# Altium schematic sheet 09 DDR3.SchDoc
size 420 x 297 mm
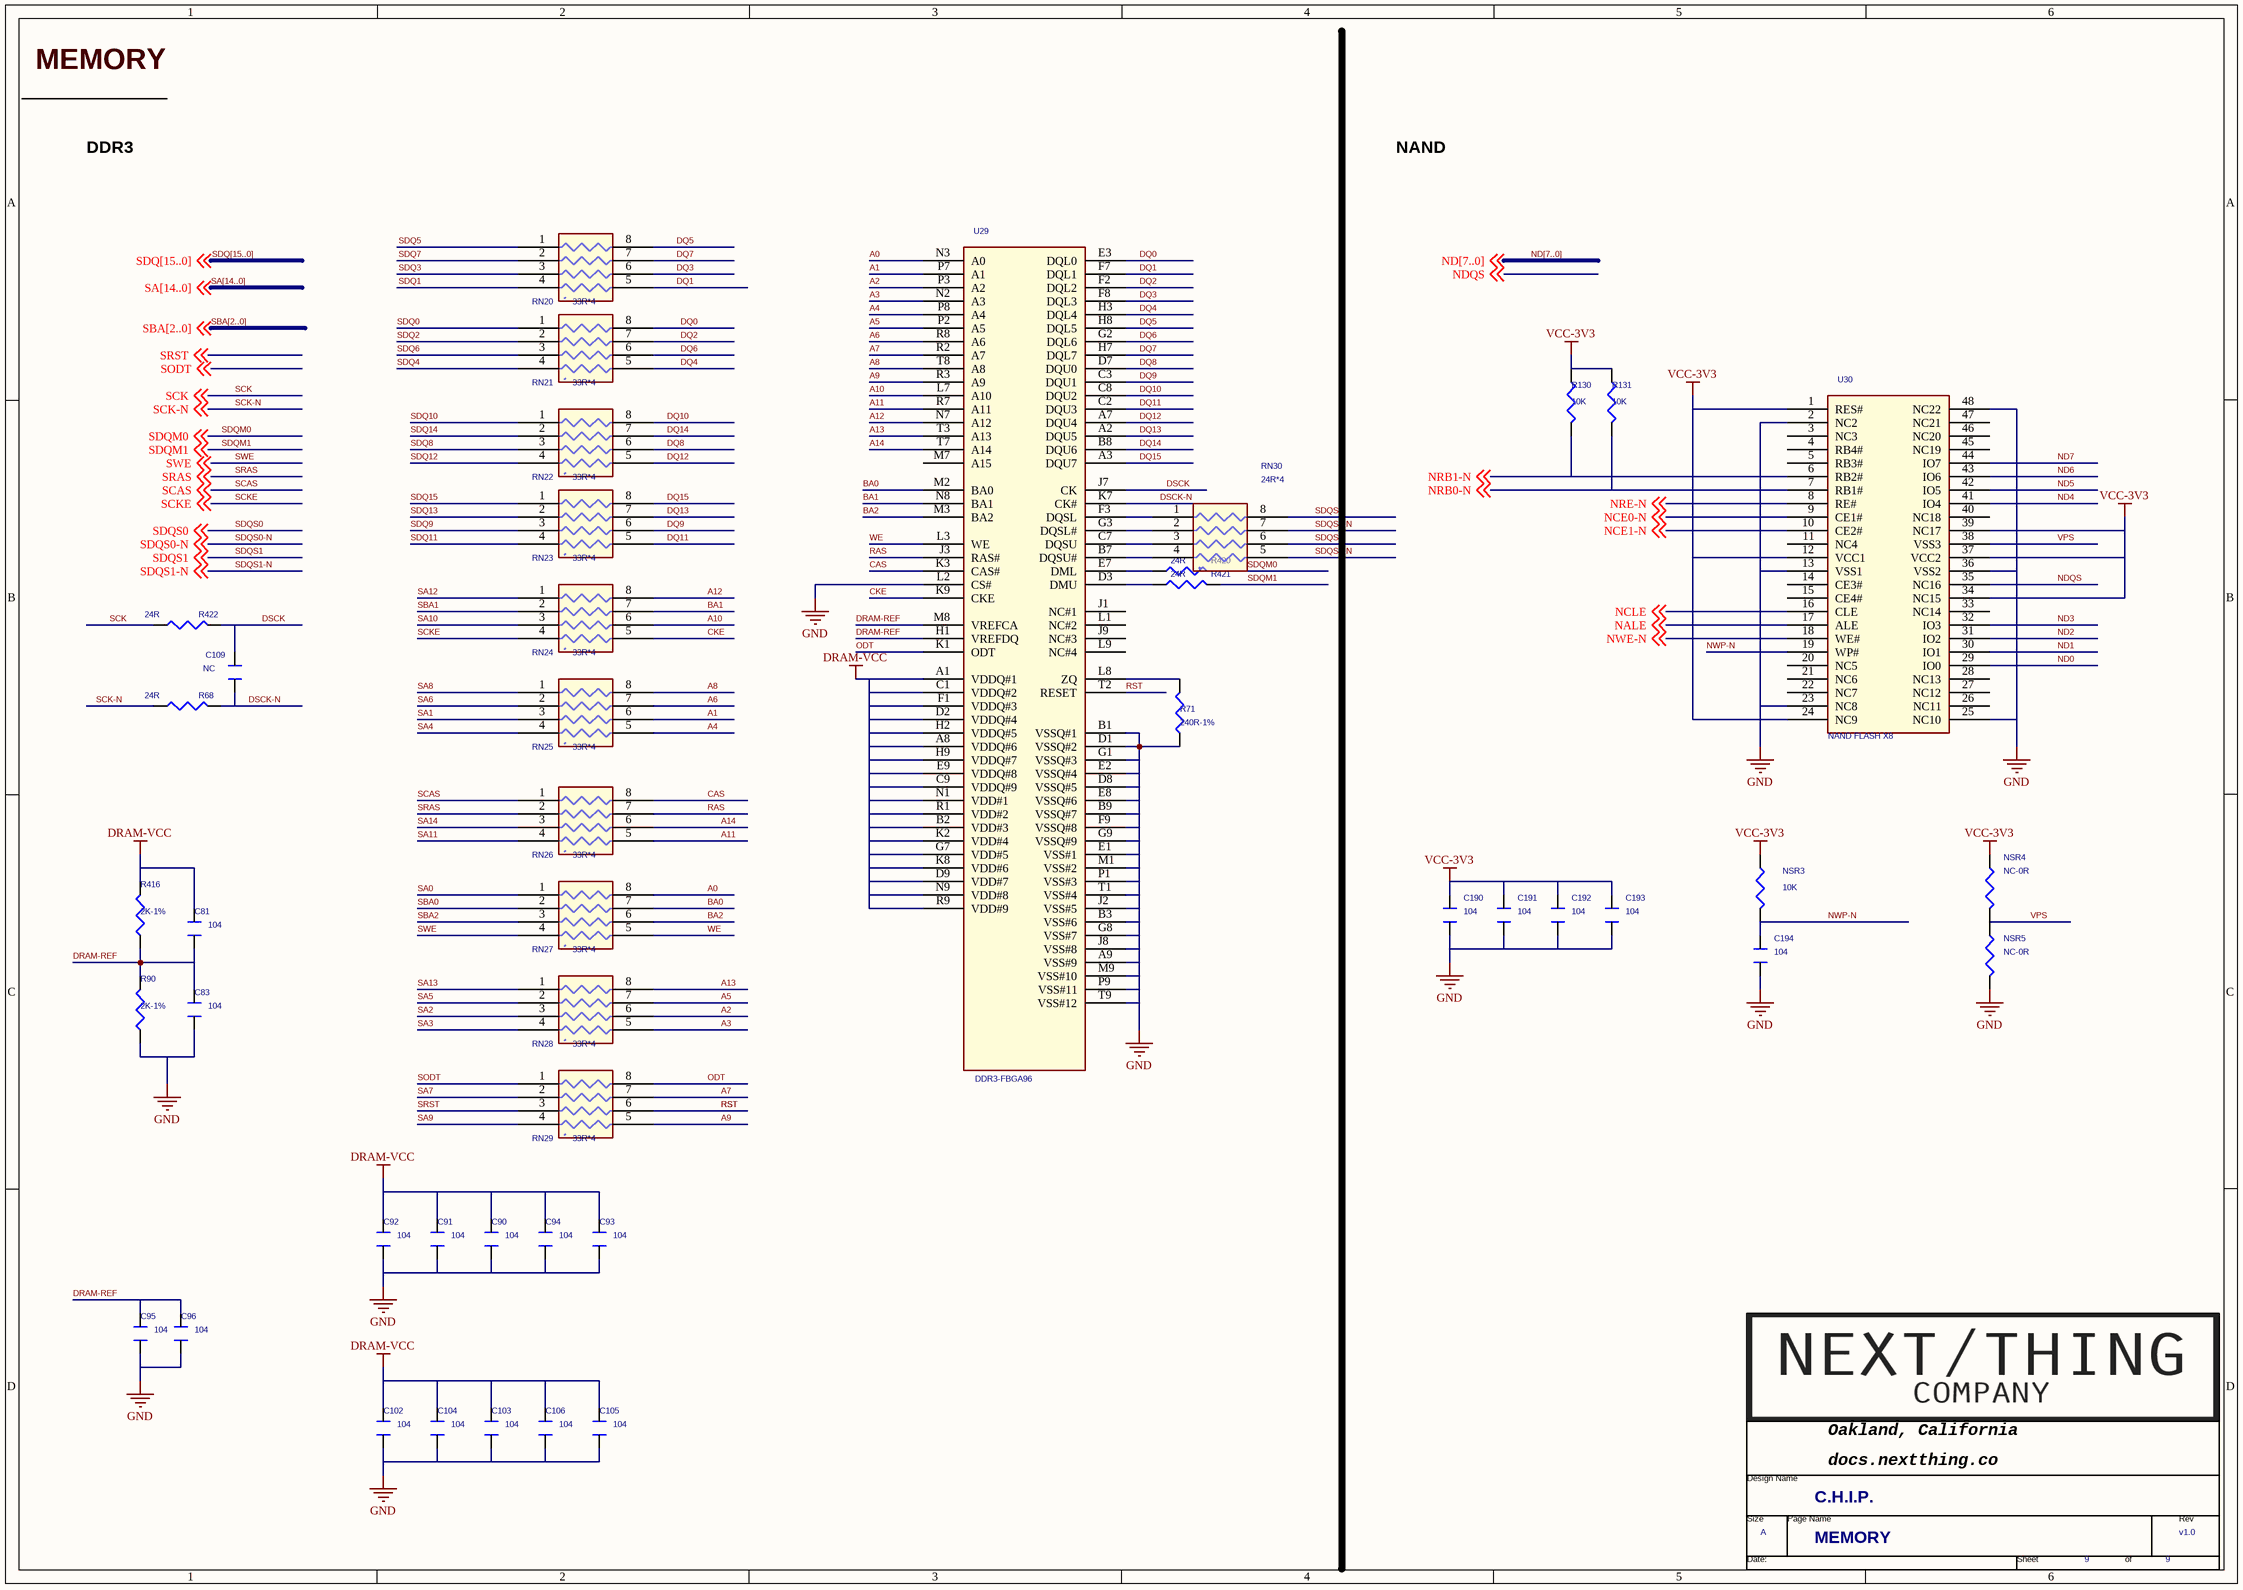
[diagram p0: 09 DDR3.SchDoc]

## Parts
*  Page Count: 9  Page Size: A  Title: C.H.I.P.  RevCode: v1.0  Doc: MEMORY  (hidden comment: TitleBlock1-nextthing)  (graphical)
C81  104  [C0201]
C83  104  [C0201]
C90  104  [0805]
C91  104  [0805]
C92  104  [0805]
C93  104  [0805]
C94  104  [0805]
C95  104  [0805]
C96  104  [0805]
C102  104  [0805]
C103  104  [0805]
C104  104  [0805]
C105  104  [0805]
C106  104  [0805]
C109  NC  [C0201]
C190  104  [C0201]
C191  104  [C0201]
C192  104  [C0201]
C193  104  [C0201]
C194  104  [C0201]
NSR3  10K  [C0201]
NSR4  NC-0R  [C0201]
NSR5  NC-0R  [C0201]
R68  24R  [0805]
R71  240R-1%  [0805]
R90  2K-1%  [R0402]
R130  10K  [C0201]
R131  10K  [C0201]
R416  2K-1%  [R0402]
R420  24R  [0805]
R421  24R  [0805]
R422  24R  [0805]
RN20  33R*4  [RN0201]
RN21  33R*4  [RN0201]
RN22  33R*4  [RN0201]
RN23  33R*4  [RN0201]
RN24  33R*4  [RN0201]
RN25  33R*4  [RN0201]
RN26  33R*4  [RN0201]
RN27  33R*4  [RN0201]
RN28  33R*4  [RN0201]
RN29  33R*4  [RN0201]
RN30  24R*4  [RN0201]
U29  DDR3-FBGA96  [FBGA96C80P9X13]
U30  NAND FLASH X8  [TSOP-48]

## Nets
DRAM-VCC: C81.2 C90.1 C91.1 C92.1 C93.1 C94.1 C102.1 C103.1 C104.1 C105.1 C106.1 R416.2 U29.A1(VDDQ#1) U29.A8(VDDQ#6) U29.B2(VDD#3) U29.C1(VDDQ#2) U29.C9(VDDQ#9) U29.D2(VDDQ#4) U29.D9(VDD#7) U29.E9(VDDQ#8) U29.F1(VDDQ#3) U29.G7(VDD#5) U29.H2(VDDQ#5) U29.H9(VDDQ#7) U29.K2(VDD#4) U29.K8(VDD#6) U29.N1(VDD#1) U29.N9(VDD#8) U29.R1(VDD#2) U29.R9(VDD#9)
GND: C83.1 C90.2 C91.2 C92.2 C93.2 C94.2 C95.2 C96.2 C102.2 C103.2 C104.2 C105.2 C106.2 C190.1 C191.1 C192.1 C193.1 C194.1 NSR5.2 R71.1 R90.1 U29.A9(VSS#9) U29.B1(VSSQ#1) U29.B3(VSS#6) U29.B9(VSSQ#7) U29.D1(VSSQ#2) U29.D8(VSSQ#5) U29.E1(VSS#1) U29.E2(VSSQ#4) U29.E8(VSSQ#6) U29.F9(VSSQ#8) U29.G1(VSSQ#3) U29.G8(VSS#7) U29.G9(VSSQ#9) U29.J2(VSS#5) U29.J8(VSS#8) U29.L2(CS#) U29.M1(VSS#2) U29.M9(VSS#10) U29.P1(VSS#3) U29.P9(VSS#11) U29.T1(VSS#4) U29.T9(VSS#12) U30.2(NC2) U30.13(VSS1) U30.23(NC8) U30.25(NC10) U30.36(VSS2) U30.48(NC22)
VCC-3V3: C190.2 C191.2 C192.2 C193.2 NSR3.1 NSR4.1 R130.1 R131.1 U30.1(RES#) U30.12(VCC1) U30.24(NC9) U30.34(NC15) U30.37(VCC2) U30.39(NC17)
A0: RN27.8(R8) U29.N3(A0)
A1: RN25.6(R6) U29.P7(A1)
A2: RN28.6(R6) U29.P3(A2)
A3: RN28.5(R5) U29.N2(A3)
A4: RN25.5(R5) U29.P8(A4)
A5: RN28.7(R7) U29.P2(A5)
A6: RN25.7(R7) U29.R8(A6)
A7: RN29.7(R7) U29.R2(A7)
A8: RN25.8(R8) U29.T8(A8)
A9: RN29.5(R5) U29.R3(A9)
A10: RN24.6(R6) U29.L7(A10)
A11: RN26.5(R5) U29.R7(A11)
A12: RN24.8(R8) U29.N7(A12)
A13: RN28.8(R8) U29.T3(A13)
A14: RN26.6(R6) U29.T7(A14)
BA0: RN27.7(R7) U29.M2(BA0)
BA1: RN24.7(R7) U29.N8(BA1)
BA2: RN27.6(R6) U29.M3(BA2)
CAS: RN26.8(R8) U29.K3(CAS#)
CKE: RN24.5(R5) U29.K9(CKE)
DQ0: RN21.8(R8) U29.E3(DQL0)
DQ1: RN20.5(R5) U29.F7(DQL1)
DQ2: RN21.7(R7) U29.F2(DQL2)
DQ3: RN20.6(R6) U29.F8(DQL3)
DQ4: RN21.5(R5) U29.H3(DQL4)
DQ5: RN20.8(R8) U29.H8(DQL5)
DQ6: RN21.6(R6) U29.G2(DQL6)
DQ7: RN20.7(R7) U29.H7(DQL7)
DQ8: RN22.6(R6) U29.D7(DQU0)
DQ9: RN23.6(R6) U29.C3(DQU1)
DQ10: RN22.8(R8) U29.C8(DQU2)
DQ11: RN23.5(R5) U29.C2(DQU3)
DQ12: RN22.5(R5) U29.A7(DQU4)
DQ13: RN23.7(R7) U29.A2(DQU5)
DQ14: RN22.7(R7) U29.B8(DQU6)
DQ15: RN23.8(R8) U29.A3(DQU7)
DRAM-REF: C81.1 C83.2 C95.1 C96.1 R90.2 R416.1 U29.H1(VREFDQ) U29.M8(VREFCA)
DSCK: C109.2 R422.1 U29.J7(CK)
DSCK-N: C109.1 R68.1 U29.K7(CK#)
NALE: U30.17(ALE) ; off-sheet NALE
NCE0-N: U30.9(CE1#) ; off-sheet NCE0-N
NCE1-N: U30.10(CE2#) ; off-sheet NCE1-N
NCLE: U30.16(CLE) ; off-sheet NCLE
ND0: U30.29(IO0)
ND1: U30.30(IO1)
ND2: U30.31(IO2)
ND3: U30.32(IO3)
ND4: U30.41(IO4)
ND5: U30.42(IO5)
ND6: U30.43(IO6)
ND7: U30.44(IO7)
NDQS: U30.35(NC16) ; off-sheet NDQS
NRB0-N: R131.2 U30.7(RB1#) ; off-sheet NRB0-N
NRB1-N: R130.2 U30.6(RB2#) ; off-sheet NRB1-N
NRE-N: U30.8(RE#) ; off-sheet NRE-N
NWE-N: U30.18(WE#) ; off-sheet NWE-N
NWP-N: C194.2 NSR3.2 U30.19(WP#)
ODT: RN29.8(R8) U29.K1(ODT)
RAS: RN26.7(R7) U29.J3(RAS#)
RST: RN29.6(R6) U29.T2(RESET)
SA0: RN27.1(R1)
SA1: RN25.3(R3)
SA2: RN28.3(R3)
SA3: RN28.4(R4)
SA4: RN25.4(R4)
SA5: RN28.2(R2)
SA6: RN25.2(R2)
SA7: RN29.2(R2)
SA8: RN25.1(R1)
SA9: RN29.4(R4)
SA10: RN24.3(R3)
SA11: RN26.4(R4)
SA12: RN24.1(R1)
SA13: RN28.1(R1)
SA14: RN26.3(R3)
SBA0: RN27.2(R2)
SBA1: RN24.2(R2)
SBA2: RN27.3(R3)
SCAS: RN26.1(R1) ; off-sheet SCAS
SCK: R422.2 ; off-sheet SCK
SCK-N: R68.2 ; off-sheet SCK-N
SCKE: RN24.4(R4) ; off-sheet SCKE
SDQ0: RN21.1(R1)
SDQ1: RN20.4(R4)
SDQ2: RN21.2(R2)
SDQ3: RN20.3(R3)
SDQ4: RN21.4(R4)
SDQ5: RN20.1(R1)
SDQ6: RN21.3(R3)
SDQ7: RN20.2(R2)
SDQ8: RN22.3(R3)
SDQ9: RN23.3(R3)
SDQ10: RN22.1(R1)
SDQ11: RN23.4(R4)
SDQ12: RN22.4(R4)
SDQ13: RN23.2(R2)
SDQ14: RN22.2(R2)
SDQ15: RN23.1(R1)
SDQM0: R420.1 ; off-sheet SDQM0
SDQM1: R421.1 ; off-sheet SDQM1
SDQS0: RN30.8(R8) ; off-sheet SDQS0
SDQS0-N: RN30.7(R7) ; off-sheet SDQS0-N
SDQS1: RN30.6(R6) ; off-sheet SDQS1
SDQS1-N: RN30.5(R5) ; off-sheet SDQS1-N
SODT: RN29.1(R1) ; off-sheet SODT
SRAS: RN26.2(R2) ; off-sheet SRAS
SRST: RN29.3(R3) ; off-sheet SRST
SWE: RN27.4(R4) ; off-sheet SWE
VPS: NSR4.2 NSR5.1 U30.38(VSS3)
WE: RN27.5(R5) U29.L3(WE)
NetR71_2: R71.2 U29.L8(ZQ)
NetR420_2: R420.2 U29.E7(DML)
NetR421_2: R421.2 U29.D3(DMU)
NetRN30_1: RN30.1(R1) U29.F3(DQSL)
NetRN30_2: RN30.2(R2) U29.G3(DQSL#)
NetRN30_3: RN30.3(R3) U29.C7(DQSU)
NetRN30_4: RN30.4(R4) U29.B7(DQSU#)

Not connected (* = marked no-connect by the designer): U29 J1(NC#1) J9(NC#3) L1(NC#2) L9(NC#4) M7(A15); U30 3(NC3) 4(RB4#) 5(RB3#) 11(NC4) 14(CE3#) 15(CE4#) 20(NC5) 21(NC6) 22(NC7) 26(NC11) 27(NC12) 28(NC13) 33(NC14) 40(NC18) 45(NC19) 46(NC20) 47(NC21)

## Buses and harness runs
bus ND[7..0]
bus SA[14..0]
bus SBA[2..0]
bus SDQ[15..0]

## Notes on the sheet
- MEMORY
- DDR3
- NAND
- (in symbol TitleBlock1-nextthing) Oakland, California; Design Name; docs.nextthing.co /; Size; Page Name; Rev; Date:; Sheet; of

## Library data of the parts
C81 C83 C109 = CAPACITOR_0_Dup3: PAGE: 1
C90-C96 C102-C106 = CAP_0
C190-C194 = CAPACITOR_0_Dup4: PAGE: 2
NSR3-NSR5 R130 R131 = R_Dup2
R68 R71 R420-R422 = R1 0805
R90 R416 = ?_0
RN20-RN30 = R-PACK4_1
U29 = DDR3_0
U30 = NAND_FLASH_X8
* = TitleBlock1-nextthing: Page Number: 9; Page Create Date: March  8, 1995